# Altium project working_2.PrjPcb
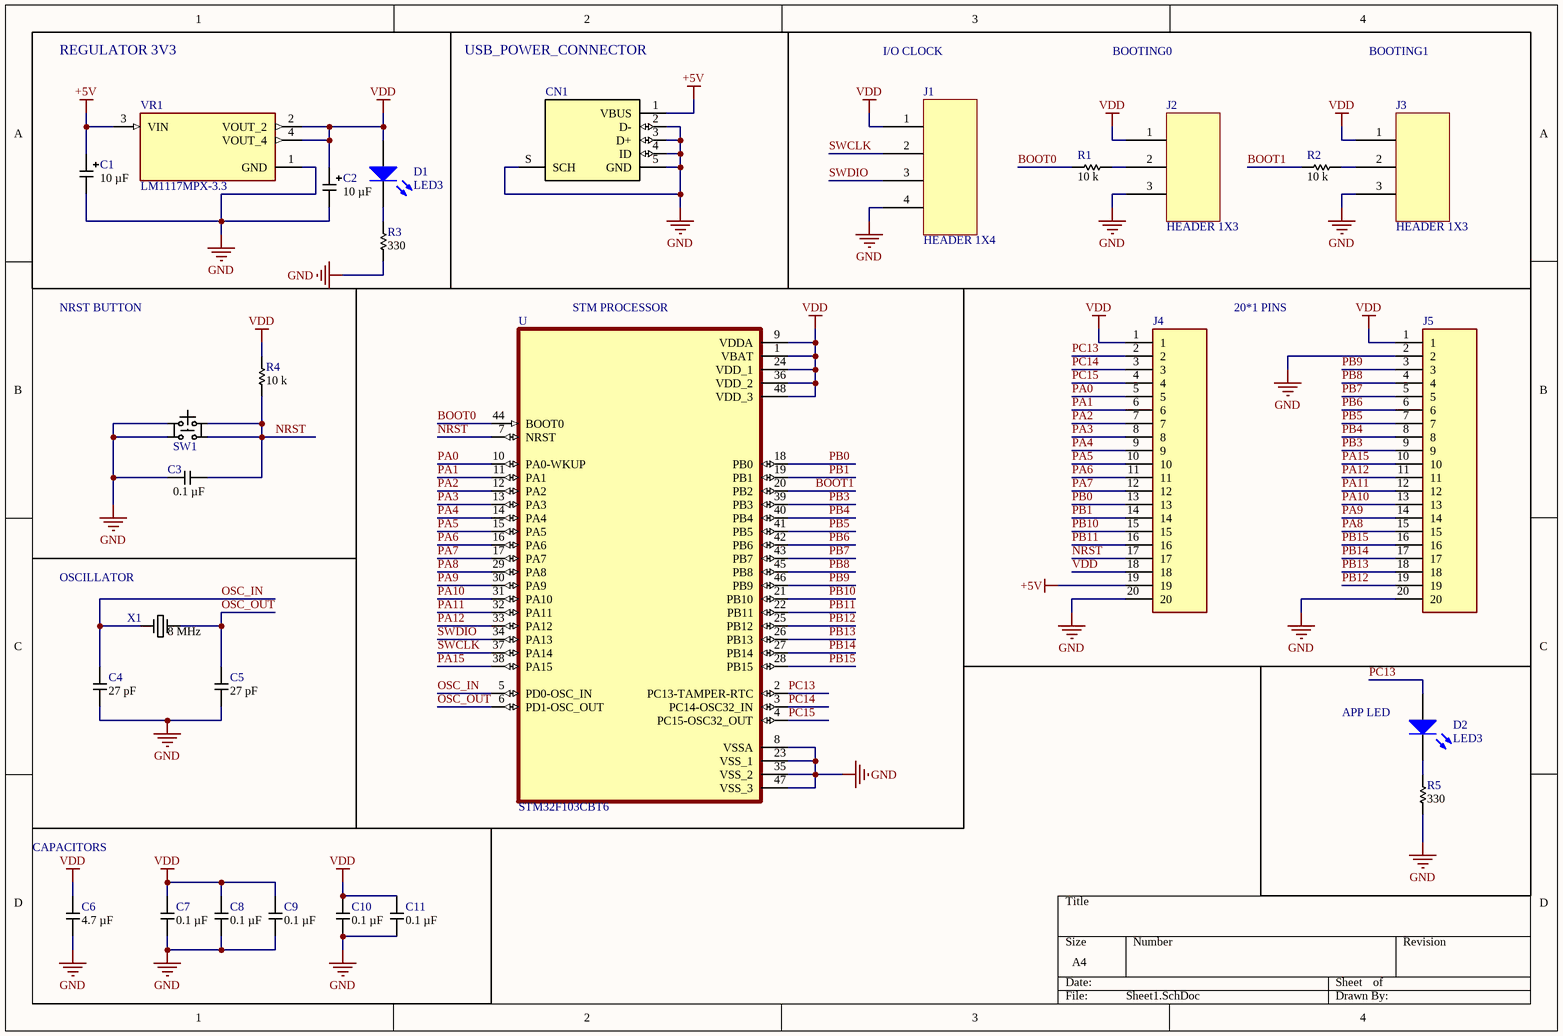
[diagram p0: Sheet1.SchDoc]
1 sheet, 28 parts. Net scope: global (net labels, ports and power ports of the same name join across sheets).
Board file: PCB1.PcbDoc

## Sheet Sheet1.SchDoc
size A4; SheetNumber: 1; SheetTotal: 1; SPICEModelCacheGQPZJUHC: <root> / <DocumentId>GQPZJUHC</DocumentId> / <CacheFrame Number="0"> / <Model Name="led3" Kind="MDL"> / <Text>*Typ BLUE SiC LED: Vf=3.4V Vr=5V If=40mA trr=3uS / *LED Pinout: 1=A, 2=K / .MODEL LED3 D (IS=93.1P RS=42M N=7.47 BV=5 IBV=30U / + CJO=2.97P VJ=.75 M=.333 TT=4.32U)</Text> / </Model> / </CacheFrame> / </root>

### Parts
C1  Capacitance: 10 µF  [KEMET_CAP_TAN-B]  (hidden comment: T495B106K025ATE750)
C2  Capacitance: 10 µF  [KEMET_CAP_TAN-B]  (hidden comment: T495B106K025ATE750)
C3  Capacitance: 0.1 µF  [SAMSUNG_CAP_0603_090]  (hidden comment: CL10B104KB8NNNC)
C4  Capacitance: 27 pF  [SAMSUNG_CAP_0805_075]  (hidden comment: CL21C270JBANNNC)
C5  Capacitance: 27 pF  [SAMSUNG_CAP_0805_075]  (hidden comment: CL21C270JBANNNC)
C6  Capacitance: 4.7 µF  [SAMSUNG_CAP_0805_095]  (hidden comment: CL21A475KACLRNC)
C7  Capacitance: 0.1 µF  [SAMSUNG_CAP_0805_095]  (hidden comment: CL21B104MACNNNC)
C8  Capacitance: 0.1 µF  [SAMSUNG_CAP_0805_095]  (hidden comment: CL21B104MACNNNC)
C9  Capacitance: 0.1 µF  [SAMSUNG_CAP_0805_095]  (hidden comment: CL21B104MACNNNC)
C10  Capacitance: 0.1 µF  [SAMSUNG_CAP_0805_095]  (hidden comment: CL21B104MACNNNC)
C11  Capacitance: 0.1 µF  [SAMSUNG_CAP_0805_095]  (hidden comment: CL21B104MACNNNC)
CN1  5UR2M01MF-105G0BUHM1  [AMTEK_5UR2M01MF-105G0BUHM1]  (value not drawn)
D1  LED3  [3.5X2.8X1.9]
D2  LED3  [3.5X2.8X1.9]
J1  HEADER 1X4  [HEADER 1X4_2.54mm]
J2  HEADER 1X3  [HEADER 1X3_2.54]
J3  HEADER 1X3  [HEADER 1X3_2.54]
J4  (no value)  [20*1 pin]
J5  (no value)  [20*1 pin]
R1  Resistance: 10 k  [ROYALOHM_RES_0603]  (hidden comment: 0603SAJ0103T5E)
R2  Resistance: 10 k  [ROYALOHM_RES_0603]  (hidden comment: 0603SAJ0103T5E)
R3  Resistance: 330  [ROYALOHM_RES_0603]  (hidden comment: 0603SAJ0331T5E)
R4  Resistance: 10 k  [ROYALOHM_RES_0603]  (hidden comment: 0603SAJ0103T5E)
R5  Resistance: 330  [ROYALOHM_RES_0603]  (hidden comment: 0603SAJ0331T5E)
SW1  434331045822  [WURTH_434331045822]  (value not drawn)
U  STM32F103CBT6  [QFP50P900X900X160-48N]
VR1  LM1117MPX-3.3  [VREG_LM1117MPX-3.3]
X1  Frequency: 8 MHz  [ABRACON_ABM7]  (hidden comment: ABM7-8.000MHZ-D2Y-T)

### Blocks framed on the sheet
REGULATOR 3V3: C1 C2 D1 R3 VR1

### Nets
+5V: C1.1 CN1.1(VBUS) J4.19 VR1.3(VIN)
GND: C1.2 C2.2 C3.1 C4.1 C5.1 C6.1 C7.1 C8.1 C9.1 C10.1 C11.1 CN1.2(D-) CN1.3(D+) CN1.4(ID) CN1.5(GND) CN1.S(SCH) J1.4 J2.3 J3.3 J4.20 J5.2 J5.20 R3.1 R5.1 SW1.1 SW1.3 U.8(VSSA) U.23(VSS_1) U.35(VSS_2) U.47(VSS_3) VR1.1(GND)
VDD: C2.1 C6.2 C7.2 C8.2 C9.2 C10.2 C11.2 D1.1(A) J1.1 J2.1 J3.1 J4.1 J4.18 J5.1 R4.2 U.1(VBAT) U.9(VDDA) U.24(VDD_1) U.36(VDD_2) U.48(VDD_3) VR1.2(VOUT_2) VR1.4(VOUT_4)
BOOT0: R1.1 U.44(BOOT0)
BOOT1: R2.1 U.20(PB2)
NRST: C3.2 J4.17 R4.1 SW1.2 SW1.4 U.7(NRST)
OSC_IN: C4.2 U.5(PD0-OSC_IN) X1.1
OSC_OUT: C5.2 U.6(PD1-OSC_OUT) X1.2
PA0: J4.5 U.10(PA0-WKUP)
PA1: J4.6 U.11(PA1)
PA2: J4.7 U.12(PA2)
PA3: J4.8 U.13(PA3)
PA4: J4.9 U.14(PA4)
PA5: J4.10 U.15(PA5)
PA6: J4.11 U.16(PA6)
PA7: J4.12 U.17(PA7)
PA8: J5.15 U.29(PA8)
PA9: J5.14 U.30(PA9)
PA10: J5.13 U.31(PA10)
PA11: J5.12 U.32(PA11)
PA12: J5.11 U.33(PA12)
PA15: J5.10 U.38(PA15)
PB0: J4.13 U.18(PB0)
PB1: J4.14 U.19(PB1)
PB3: J5.9 U.39(PB3)
PB4: J5.8 U.40(PB4)
PB5: J5.7 U.41(PB5)
PB6: J5.6 U.42(PB6)
PB7: J5.5 U.43(PB7)
PB8: J5.4 U.45(PB8)
PB9: J5.3 U.46(PB9)
PB10: J4.15 U.21(PB10)
PB11: J4.16 U.22(PB11)
PB12: J5.19 U.25(PB12)
PB13: J5.18 U.26(PB13)
PB14: J5.17 U.27(PB14)
PB15: J5.16 U.28(PB15)
PC13: D2.1(A) J4.2 U.2(PC13-TAMPER-RTC)
PC14: J4.3 U.3(PC14-OSC32_IN)
PC15: J4.4 U.4(PC15-OSC32_OUT)
SWCLK: J1.2 U.37(PA14)
SWDIO: J1.3 U.34(PA13)
NetD1_2: D1.2(K) R3.2
NetD2_2: D2.2(K) R5.2
NetJ2_2: J2.2 R1.2
NetJ3_2: J3.2 R2.2

### Notes on the sheet
- USB_POWER_CONNECTOR
- I/O CLOCK
- BOOTING0
- BOOTING1
- NRST BUTTON
- (near U) STM PROCESSOR
- 20*1 PINS
- (near X1) OSCILLATOR
- (near D2) APP LED
- (near C6) CAPACITORS

### Library data of the parts
C1 C2 = T495B106K025ATE750: CAP TANT 10UF 10% 25V 1411; Supplier 1: Digi-Key; Supplier 2: Farnell; Supplier 3: Mouser; Supplier Part Number 1: 399-18418-1-ND; Supplier Part Number 2: 2470989; Supplier Part Number 3: 80-T495B106K25ATE750
C3 = CL10B104KB8NNNC: CAP CER 0.1UF 50V X7R 0603; Supplier 1: Digi-Key; Supplier 2: Mouser; Supplier 3: Arrow Electronics; Supplier Part Number 1: 1276-1000-6-ND; Supplier Part Number 2: 187-CL10B104KB8NNNC; Supplier Part Number 3: CL10B104KB8NNNC
C4 C5 = CL21C270JBANNNC: CAP CER 27PF 50V C0G/NP0 0805; Supplier 1: Digi-Key; Supplier Part Number 1: 1276-1285-1-ND
C6 = CL21A475KACLRNC: CAP CER 4.7UF 25V X5R 0805; Supplier 1: Digi-Key; Supplier 2: Mouser; Supplier 3: Arrow Electronics; Supplier Part Number 1: 1276-2415-1-ND; Supplier Part Number 2: 187-CL21A475KACLRNC; Supplier Part Number 3: CL21A475KACLRNC
C7-C11 = CL21B104MACNNNC: CAP CER 0.1UF 25V X7R 0805; Supplier 1: Digi-Key; Supplier 2: Mouser; Supplier 3: Arrow Electronics; Supplier Part Number 1: 1276-2449-1-ND; Supplier Part Number 2: 187-CL21B104MACNNNC; Supplier Part Number 3: CL21B104MACNNNC
CN1 = 5UR2M01MF-105G0BUHM1: CONN RCPT MICRO USB AB 5P SMD RA
D1 D2 = LED3: Typical BLUE SiC LED; Published: 8-Jun-2000; LatestRevisionDate: 17-Dec-2003; LatestRevisionNote: PCB Footprint replaced.; DatasheetVersion: 16-Apr-2002; PackageVersion: 16-Apr-2002; PackageReference: 3.5X2.8X1.9; Publisher: Altium Limited; PackageDescription: SM LED; 2 C-Bend Leads; Body 3.5 x 2.8 x 1.9 mm, inc leads (LxWxH typ)
J4 J5 = 20 pin header
R1 R2 R4 = 0603SAJ0103T5E: RES SMD 10K OHM 5% 1/10W 0603
R3 R5 = 0603SAJ0331T5E: RES SMD 330R OHM 5% 1/10W 0603
SW1 = 434331045822: SWITCH TACTILE SPST-NO 0.05A 12V; Supplier 1: Digi-Key; Supplier 2: Farnell; Supplier 3: Mouser; Supplier Part Number 1: 732-7055-1-ND; Supplier Part Number 2: 1867997; Supplier Part Number 3: 710-434331045822
U = STM32F103CBT6: ARMÂ® CortexÂ®-M3 STM32F1 Microcontroller IC 32-Bit 72MHz 128KB _128K x 8_ FLASH; MF: STMicroelectronics; Package: LQFP-48 STMicroelectronics; Availability: Unavailable; MP: STM32F103CBT6; Value: *; SnapEDA_Link: https://www.snapeda.com/parts/STM32F103CBT6/STMicroelectronics/view-part/38865/?ref=snap; Price: None
VR1 = LM1117MPX-3.3: 800-mA 15-V linear voltage regulator; MF: Texas Instruments; Check_prices: https://www.snapeda.com/parts/LM1117MPX-3.3/Texas+Instruments/view-part/?ref=eda; Value: *; Availability: In Stock; MP: LM1117MPX-3.3; Price: None; Package: SOT-223-4 Texas Instruments; SnapEDA_Link: https://www.snapeda.com/parts/LM1117MPX-3.3/Texas+Instruments/view-part/?ref=snap; Purchase-URL: https://pricing.snapeda.com/search/part/LM1117MPX-3.3/?ref=eda
X1 = ABM7-8.000MHZ-D2Y-T: CRYSTAL 8.0000MHZ 18PF SMD; Supplier 1: Digi-Key; Supplier 2: Farnell; Supplier 3: Mouser; Supplier 4: Arrow Electronics; Supplier Part Number 1: 535-9831-6-ND; Supplier Part Number 2: 2101337; Supplier Part Number 3: 815-ABM7-8-D2Y-T; Supplier Part Number 4: ABM7-8.000MHZ-D2Y-T